# EasyEDA Pro project EMG_v0.0.eprj

# Schematic EMG_v0.0
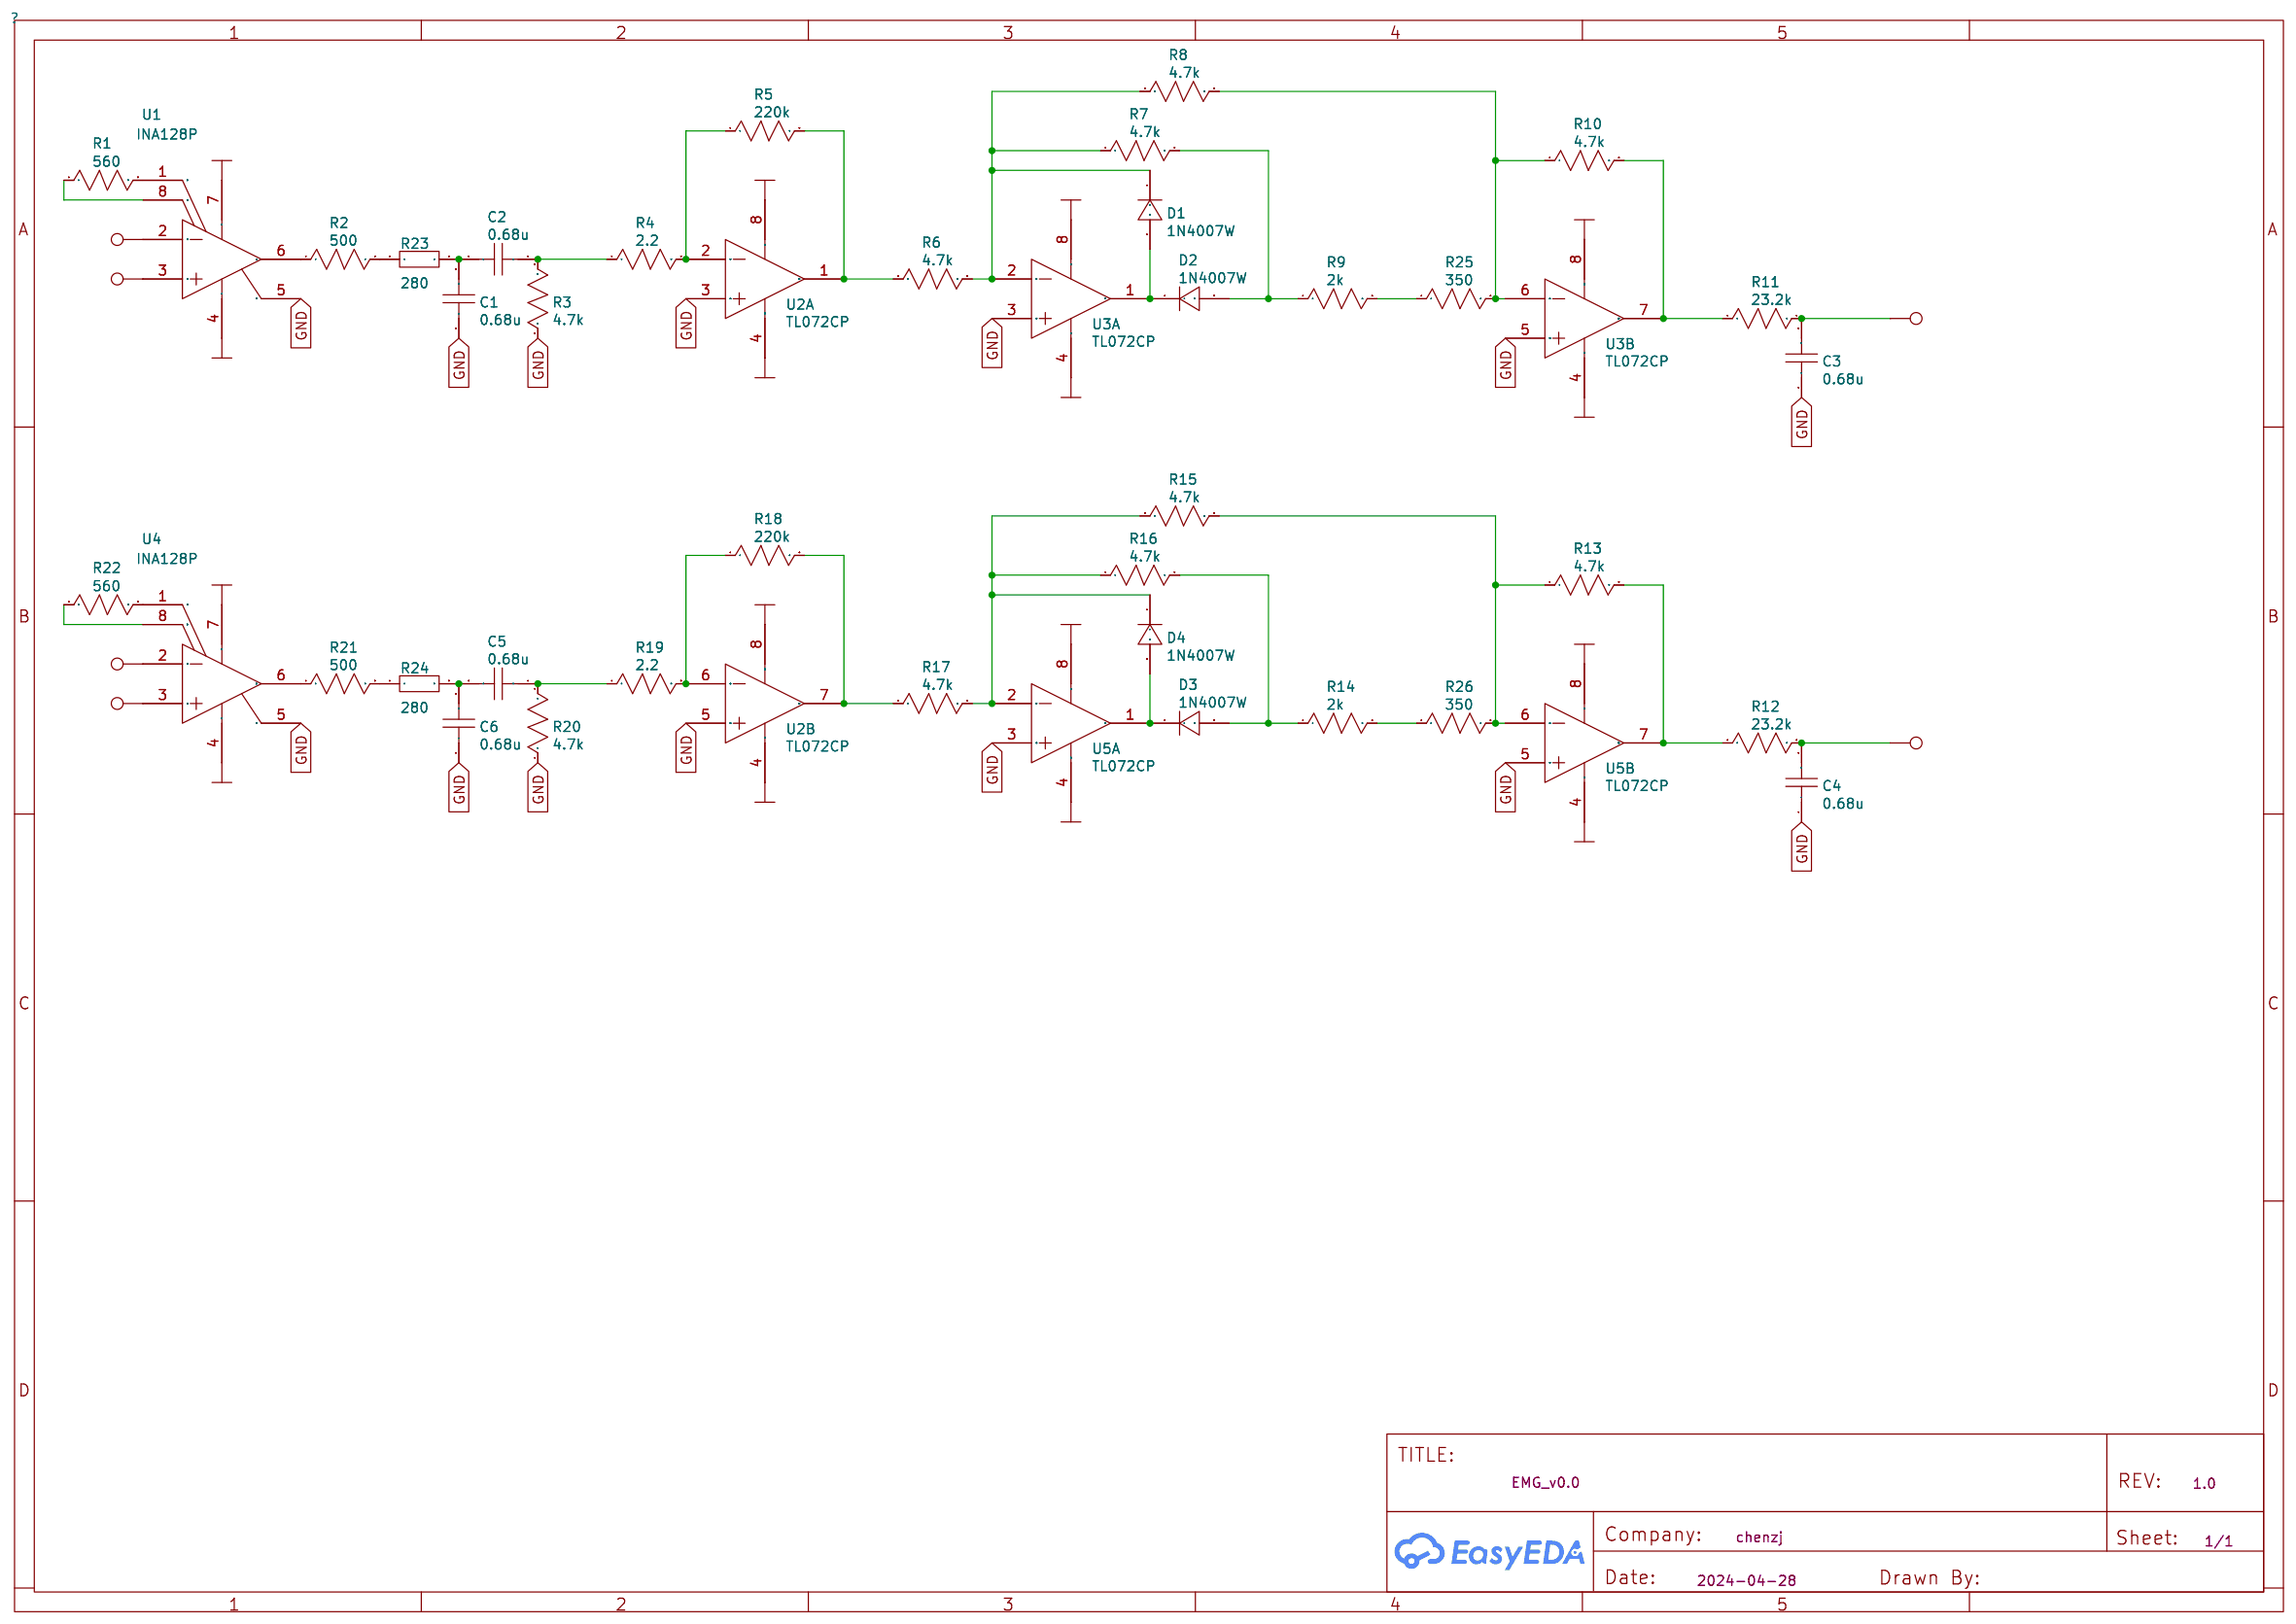
[diagram p0: schematic sheet]

## Parts
C1  0.68u  [C0603]
C2  0.68u  [C0603]
C3  0.68u  [C0603]
C4  0.68u  [C0603]
C5  0.68u  [C0603]
C6  0.68u  [C0603]
D1  1N4007W  [SOD-123_L2.8-W1.8-LS3.7-RD]
D2  1N4007W  [SOD-123_L2.8-W1.8-LS3.7-RD]
D3  1N4007W  [SOD-123_L2.8-W1.8-LS3.7-RD]
D4  1N4007W  [SOD-123_L2.8-W1.8-LS3.7-RD]
R1  560  [R0603]
R2  500  [R0603]
R3  4.7k  [R0603]
R4  2.2  [R0603]
R5  220k  [R0603]
R6  4.7k  [R0603]
R7  4.7k  [R0603]
R8  4.7k  [R0603]
R9  2k  [R0603]
R10  4.7k  [R0603]
R11  23.2k  [R0603]
R12  23.2k  [R0603]
R13  4.7k  [R0603]
R14  2k  [R0603]
R15  4.7k  [R0603]
R16  4.7k  [R0603]
R17  4.7k  [R0603]
R18  220k  [R0603]
R19  2.2  [R0603]
R20  4.7k  [R0603]
R21  500  [R0603]
R22  560  [R0603]
R23  280  [R0201]
R24  280  [R0201]
R25  350  [R0603]
R26  350  [R0603]
U1  INA128P  [PDIP-8_L9.6-W6.4-P2.54-LS7.9-BL]
U2  TL072CP  [DIP-8_L9.6-W6.4-P2.54-LS7.6-BL-1]  (sections 1,2)
U3  TL072CP  [DIP-8_L9.6-W6.4-P2.54-LS7.6-BL-1]  (sections 1,2)
U4  INA128P  [PDIP-8_L9.6-W6.4-P2.54-LS7.9-BL]
U5  TL072CP  [DIP-8_L9.6-W6.4-P2.54-LS7.6-BL-1]  (sections 1,2)

## Library data of the parts
C1 C2 C5 C6 = 0.68u
C3 C4 = 680n
D1-D4 = 1N4007W: Supplier: LCSC; Supplier Part: C328592; Manufacturer: BLUE ROCKET
R1 R22 = 560
R2 R21 = 780
R3 R6-R8 R10 R13 R15-R17 R20 = 4.7k
R4 R19 = 2.2
R5 R18 = 220k
R9 R14 R25 R26 = 2.35k
R11 R12 = 23.2k
R23 R24 = Res_0201: Supplier Footprint: 0201
U1 U4 = INA128P: Supplier: LCSC; Supplier Part: C1348601; Manufacturer: TI(德州仪器); JLCPCB Part Class: Extended Part
U2 U3 U5 = TL072CP: tags: FET Operational Amplifier; Supplier Part: C7236; Supplier: LCSC; Manufacturer: TI(德州仪器); JLCPCB Part Class: Extended Part

## Nets
+5V: U1.7(V+) U2.8(VCC+) U3.8(VCC+) U4.7(V+) U5.8(VCC+)
-5V: U1.4(V-) U2.4(VCC-) U3.4(VCC-) U4.4(V-) U5.4(VCC-)
GND: C1.1 C3.1 C4.1 C6.1 R3.1 R20.1 U1.5(Ref) U2.3(IN1+) U2.5(IN1+) U3.3(IN1+) U3.5(IN1+) U4.5(Ref) U5.3(IN1+) U5.5(IN1+)
VIN1+: U1.3(V+IN)
VIN1-: U1.2(V-IN)
VIN2+: U4.3(V+IN)
VIN2-: U4.2(V-IN)
VOUT1: C3.2 R11.2
VOUT2: C4.2 R12.2
$1N1: R1.1 U1.8(RG)
$1N3: C2.1 R3.2 R4.1
$1N4: R4.2 R5.1 U2.2(IN1-)
$1N5: R5.2 R6.1 U2.1(OUT1)
$1N6: D1.2 D2.1 U3.1(OUT1)
$1N7: D1.1 R6.2 R7.1 R8.1 U3.2(IN1-)
$1N9: D2.2 R7.2 R9.1
$1N10: R8.2 R10.1 R25.2 U3.6(IN1-)
$1N11: R10.2 R11.1 U3.7(OUT1)
$1N14: R12.1 R13.2 U5.7(OUT1)
$1N15: R13.1 R15.2 R26.2 U5.6(IN1-)
$1N17: D3.2 R14.1 R16.2
$1N18: D4.1 R15.1 R16.1 R17.2 U5.2(IN1-)
$1N20: D3.1 D4.2 U5.1(OUT1)
$1N21: R17.1 R18.2 U2.7(OUT1)
$1N22: R18.1 R19.2 U2.6(IN1-)
$1N23: C5.1 R19.1 R20.2
$1N24: R21.1 U4.6(VO)
$1N25: R22.1 U4.8(RG)
$1N715: R1.2 U1.1(RG)
$1N782: R22.2 U4.1(RG)
$1N1481: R2.1 U1.6(VO)
$1N1483: R2.2 R23.1
$1N1485: C1.2 C2.2 R23.2
$1N1511: C5.2 C6.2 R24.2
$1N1513: R21.2 R24.1
$1N2101: R9.2 R25.1
$1N2125: R14.2 R26.1

# Board PCB_EMG_v0.0
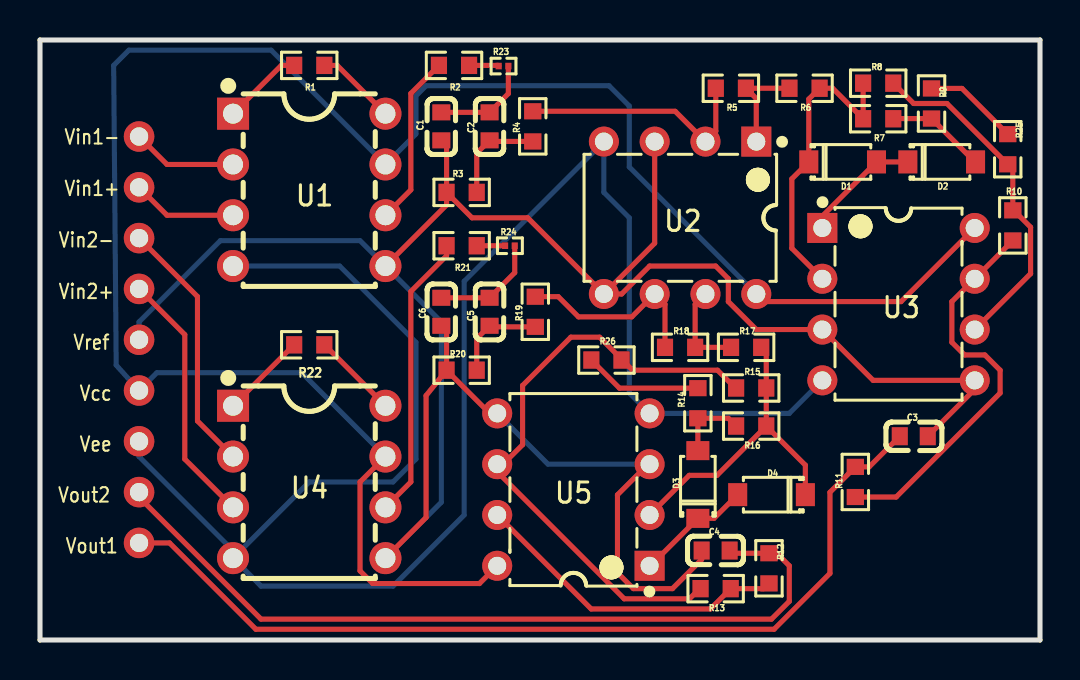
[diagram p1: board, top side]
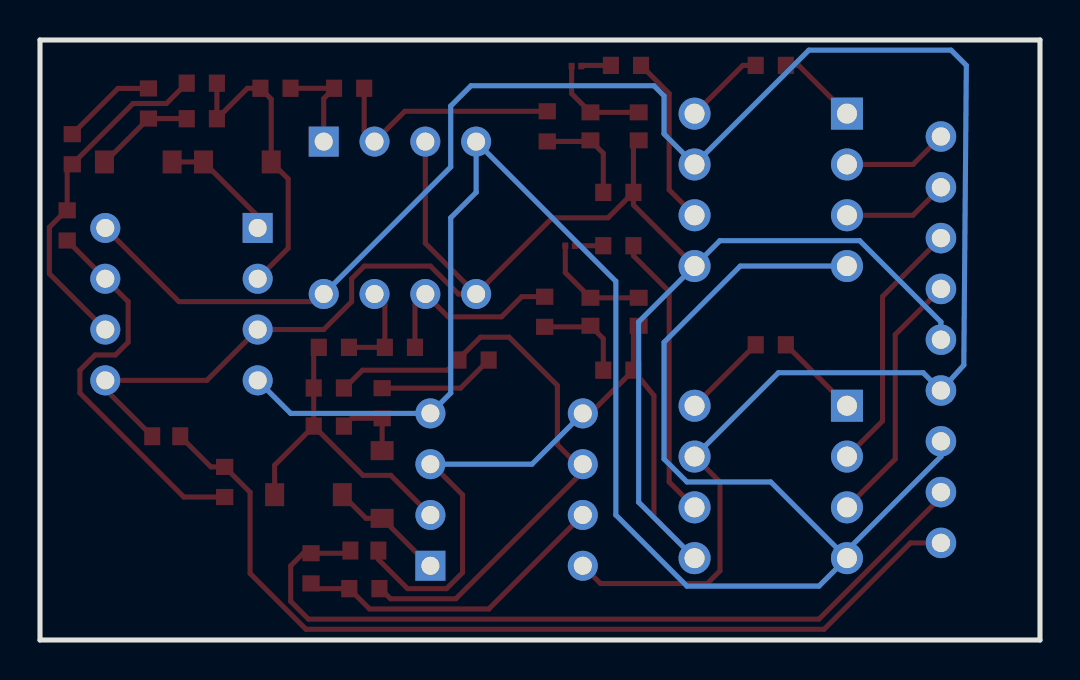
[diagram p2: board, bottom side, seen from below]

Outline 50 x 30 mm; copper layers: Top Layer, Bottom Layer. Coordinates in mm from the lower left corner of the outline.
Outline path: 0,30 50,30 50,0 0,0 0,30
Stack: Top Layer 0.035mm / Dielectric1 1.51mm FR4 er 4.5 / Bottom Layer 0.035mm

## Design rules (mm)
spacing Default (default): track to track 0.152, other pairs 0 to 0.152
track width Default (default): min 0.254, default 0.254, max 25.4
differential pair differentialPair (default): width min 0.127, default 0.254, max 2.54; gap min 0.152, default 0.152
via Default (default): diameter min 0.61, default 0.61, max 100.025; hole min 0.305, default 0.305, max 59.995

## Placement (name value [footprint] x y rotation side)
C1  0.68u  [C0603]  20.07 25.68 90 top
C2  0.68u  [C0603]  22.48 25.68 90 top
C3  0.68u  [C0603]  43.69 10.19 180 top
C4  0.68u  [C0603]  33.78 4.47 0 top
C5  0.68u  [C0603]  22.48 16.41 90 top
C6  0.68u  [C0603]  20.07 16.41 90 top
D1  1N4007W  [SOD-123_L2.8-W1.8-LS3.7-RD]  40.13 23.9 0 top
D2  1N4007W  [SOD-123_L2.8-W1.8-LS3.7-RD]  45.08 23.9 0 top
D3  1N4007W  [SOD-123_L2.8-W1.8-LS3.7-RD]  32.89 7.78 90 top
D4  1N4007W  [SOD-123_L2.8-W1.8-LS3.7-RD]  36.58 7.27 180 top
NOREF  -  [Pad_e657]  4.95 15.01 0 top
NOREF#2  -  [Pad_e661]  4.95 4.85 0 top
NOREF#3  -  [Pad_e660]  4.95 7.39 0 top
NOREF#4  -  [Pad_e654]  4.95 22.63 0 top
NOREF#5  -  [Pad_e655]  4.95 20.09 0 top
NOREF#6  -  [Pad_e658]  4.95 12.47 0 top
NOREF#7  -  [Pad_e659]  4.95 9.93 0 top
NOREF#8  -  [Pad_e653]  4.95 25.17 0 top
NOREF#9  -  [Pad_e656]  4.95 17.55 0 top
R1  560  [R0603]  13.46 28.73 180 top
R2  500  [R0603]  20.7 28.73 0 top
R3  4.7k  [R0603]  21.08 22.38 0 top
R4  2.2  [R0603]  24.64 25.68 90 top
R5  220k  [R0603]  34.54 27.59 0 top
R6  4.7k  [R0603]  38.23 27.59 0 top
R7  4.7k  [R0603]  41.91 26.06 0 top
R8  4.7k  [R0603]  41.91 27.84 0 top
R9  2k  [R0603]  44.58 26.83 90 top
R10  4.7k  [R0603]  48.64 20.73 270 top
R11  23.2k  [R0603]  40.77 7.9 90 top
R12  23.2k  [R0603]  36.45 3.58 90 top
R13  4.7k  [R0603]  33.78 2.57 0 top
R14  2k  [R0603]  32.89 11.84 90 top
R15  4.7k  [R0603]  35.56 12.6 180 top
R16  4.7k  [R0603]  35.56 10.7 180 top
R17  4.7k  [R0603]  35.31 14.63 0 top
R18  220k  [R0603]  32 14.63 0 top
R19  2.2  [R0603]  24.77 16.41 90 top
R20  4.7k  [R0603]  21.08 13.49 0 top
R21  500  [R0603]  21.08 19.71 0 top
R22  560  [R0603]  13.46 14.76 180 top
R23  280  [R0201]  23.18 28.7 0 top
R24  280  [R0201]  23.49 19.71 0 top
R25  350  [R0603]  48.39 24.54 270 top
R26  350  [R0603]  28.32 14 0 top
U1  INA128P  [PDIP-8_L9.6-W6.4-P2.54-LS7.9-BL]  13.46 22.51 270 top
U2  TL072CP  [DIP-8_L9.6-W6.4-P2.54-LS7.6-BL-1]  32 21.11 180 top
U3  TL072CP  [DIP-8_L9.6-W6.4-P2.54-LS7.6-BL-1]  42.93 16.79 270 top
U4  INA128P  [PDIP-8_L9.6-W6.4-P2.54-LS7.9-BL]  13.46 7.9 270 top
U5  TL072CP  [DIP-8_L9.6-W6.4-P2.54-LS7.6-BL-1]  26.67 7.52 90 top

## Footprints (pads in the part's own frame, mm; a bottom-side part is the same pattern mirrored in y, then rotated)
C0603
  rect 0.8x0.9 smd: 1(-0.7,0) 2(0.7,0)
DIP-8_L9.6-W6.4-P2.54-LS7.6-BL-1
  rect 1.5x1.5 hole 0.9: 1(-3.81,-3.81)
  round 1.5 hole 0.9: 2(-1.27,-3.81) 3(1.27,-3.81) 4(3.81,-3.81) 5(3.81,3.81) 6(1.27,3.81) 7(-1.27,3.81) 8(-3.81,3.81)
Pad_e653
  round 1.524 hole 0.914: 1(0,0)
Pad_e654
  round 1.524 hole 0.914: 2(0,0)
Pad_e655
  round 1.524 hole 0.914: 3(0,0)
Pad_e656
  round 1.524 hole 0.914: 4(0,0)
Pad_e657
  round 1.524 hole 0.914: 5(0,0)
Pad_e658
  round 1.524 hole 0.914: 6(0,0)
Pad_e659
  round 1.524 hole 0.914: 7(0,0)
Pad_e660
  round 1.524 hole 0.914: 9(0,0)
Pad_e661
  round 1.524 hole 0.914: 10(0,0)
PDIP-8_L9.6-W6.4-P2.54-LS7.9-BL
  rect 1.6x1.6 hole 1: 1(-3.81,-3.81)
  round 1.6 hole 1: 2(-1.27,-3.81) 3(1.27,-3.81) 4(3.81,-3.81) 5(3.81,3.81) 6(1.27,3.81) 7(-1.27,3.81) 8(-3.81,3.81)
R0201
  rect 0.303x0.324 smd: 1(-0.241,0) 2(0.241,0)
R0603
  rect 0.806x0.864 smd: 1(-0.753,0) 2(0.753,0)
SOD-123_L2.8-W1.8-LS3.7-RD
  rect 0.95x1.15 smd: 1(-1.692,0) 2(1.692,0)

## Nets
+5V: NOREF#6.6 U1.7 U2.8 U3.8 U4.7 U5.8
-5V: NOREF#7.7 U1.4 U2.4 U3.4 U4.4 U5.4
GND: C1.1 C3.1 C4.1 C6.1 NOREF.5 R3.1 R20.1 U1.5 U2.3 U2.5 U3.3 U3.5 U4.5 U5.3 U5.5
VIN1+: NOREF#4.2 U1.3
VIN1-: NOREF#8.1 U1.2
VIN2+: NOREF#9.4 U4.3
VIN2-: NOREF#5.3 U4.2
VOUT1: C3.2 NOREF#2.10 R11.2
VOUT2: C4.2 NOREF#3.9 R12.2
$1N1: R1.1 U1.8
$1N3: C2.1 R3.2 R4.1
$1N4: R4.2 R5.1 U2.2
$1N5: R5.2 R6.1 U2.1
$1N6: D1.2 D2.1 U3.1
$1N7: D1.1 R6.2 R7.1 R8.1 U3.2
$1N9: D2.2 R7.2 R9.1
$1N10: R8.2 R10.1 R25.2 U3.6
$1N11: R10.2 R11.1 U3.7
$1N14: R12.1 R13.2 U5.7
$1N15: R13.1 R15.2 R26.2 U5.6
$1N17: D3.2 R14.1 R16.2
$1N18: D4.1 R15.1 R16.1 R17.2 U5.2
$1N20: D3.1 D4.2 U5.1
$1N21: R17.1 R18.2 U2.7
$1N22: R18.1 R19.2 U2.6
$1N23: C5.1 R19.1 R20.2
$1N24: R21.1 U4.6
$1N25: R22.1 U4.8
$1N715: R1.2 U1.1
$1N782: R22.2 U4.1
$1N1481: R2.1 U1.6
$1N1483: R2.2 R23.1
$1N1485: C1.2 C2.2 R23.2
$1N1511: C5.2 C6.2 R24.2
$1N1513: R21.2 R24.1
$1N2101: R9.2 R25.1
$1N2125: R14.2 R26.1

## Routing (per net, layer and track width the routed paths; a pad name or vN(x,y) marks a point on that pad's centre or on a via; arc(x,y) is an arc through that point)
+5V: length 87.4
  Top Layer w0.254: U3.8 43.05,16.92 36.2,16.92 U2.8
  Bottom Layer w0.254: U2.8 29.46,23.65 29.46,26.7 28.45,27.71 19.3,27.71 18.8,27.21 18.8,25.3 U1.7 11.56,29.49 4.45,29.49 3.68,28.73 3.81,13.74 NOREF#6.6 5.84,13.36 13.08,13.36 U4.7
-5V: length 70.7
  Bottom Layer w0.254: U2.4 21.21,17.94 21.21,6.25 17.65,2.7 11.05,2.7 U4.4 ; U4.4 9.65,4.47 4.95,9.17 NOREF#7.7 ; U4.4 13.46,7.9 17.65,7.9 18.8,9.05 18.8,14.89 14.99,18.7 U1.4
GND: length 97.5
  Top Layer w0.254: C1.1 20.33,24.72 R3.1 ; U2.5 29.08,17.3 30.48,18.7 33.78,18.7 34.42,18.06 34.42,16.92 35.81,15.52 U3.3 41.66,12.98 U3.5 46.74,12.54 C3.1 ; U2.5 24.38,21.11 21.6,21.11 R3.1 ; U2.5 30.73,19.84 U2.3 ; R3.1 20.33,21.75 U1.5 ; C6.1 20.33,15.45 R20.1 19.3,12.22 19.3,6.12 U4.5
  Bottom Layer w0.254: U4.5 20.07,6.89 20.07,15.9 U1.5 16,19.97 9.02,19.97 4.95,15.9 NOREF.5
VIN1+: length 5.3
  Top Layer w0.254: U1.3 6.35,21.24 NOREF#4.2
VIN1-: length 5.3
  Top Layer w0.254: NOREF#8.1 6.35,23.78 U1.2
VIN2+: length 12.9
  Top Layer w0.254: NOREF#9.4 7.24,15.27 7.24,9.05 U4.3
VIN2-: length 12.9
  Top Layer w0.254: NOREF#5.3 7.87,17.17 7.87,10.95 U4.2
VOUT1: length 46.2
  Top Layer w0.254: C3.2 41.46,8.66 R11.2 39.5,7.39 39.5,3.33 36.7,0.54 10.8,0.54 6.48,4.85 NOREF#2.10
VOUT2: length 40.7
  Top Layer w0.254: NOREF#3.9 4.95,7.14 11.05,1.04 36.58,1.04 37.46,1.93 37.46,3.71 36.84,4.34 R12.2 34.62,4.34 C4.2
$1N1: length 4.1
  Top Layer w0.254: R1.1 14.86,28.73 U1.8
$1N3: length 5
  Top Layer w0.254: R3.2 21.84,24.34 C2.1 22.53,24.93 R4.1
$1N4: length 12.1
  Top Layer w0.254: R5.1 33.79,25.44 U2.2 31.76,26.44 R4.2
$1N5: length 5.1
  Top Layer w0.254: U2.1 35.81,27.07 R5.2 R6.1
$1N6: length 6
  Top Layer w0.254: D2.1 D1.2 39.12,21.2 U3.1
$1N7: length 15.3
  Top Layer w0.254: R8.1 R7.1 39.63,27.59 38.98,27.59 ; U3.2 37.59,19.59 37.59,23.06 D1.1 38.44,27.05 R6.2
$1N9: length 5
  Top Layer w0.254: D2.2 46.74,23.9 R9.1 42.67,26.07 R7.2
$1N11: length 19.9
  Top Layer w0.254: R10.2 U3.7 45.59,16.92 45.59,14.89 46.23,14.25 47.24,14.25 48.01,13.49 48.01,12.35 42.81,7.15 R11.1
$1N17: length 3.7
  Top Layer w0.254: R16.2 34.42,11.09 R14.1 D3.2
$1N21: length 4.7
  Top Layer w0.254: U2.7 32.76,16.78 R18.2 R17.1
$1N22: length 9.7
  Top Layer w0.254: 24.77,17.17 25.92,17.17 26.92,16.16 29.59,16.16 U2.6 31.25,16.78 R18.1
$1N23: length 4.8
  Top Layer w0.254: R19.1 22.53,15.66 C5.1 21.84,15.07 R20.2
$1N24: length 14.3
  Top Layer w0.254: R21.1 20.33,19.21 18.54,17.43 18.54,7.9 U4.6
$1N25: length 4.3
  Top Layer w0.254: U4.8 14.22,14.76 R22.1
$1N715: length 4.1
  Top Layer w0.254: R1.2 12.07,28.73 U1.1
$1N782: length 4.3
  Top Layer w0.254: R22.2 12.7,14.76 U4.1
$1N1481: length 8.6
  Top Layer w0.254: 19.95,28.73 18.54,27.33 18.54,22.51 U1.6
$1N10: length 17.3
  Top Layer w0.254: R8.2 43.68,26.83 45.35,26.83 R25.2 ; 48.39,23.74 48.64,23.49 R10.1 ; 48.64,21.53 49.53,20.64 49.53,18.32 U3.6
$1N14: length 16.1
  Top Layer w0.254: U5.7 27.56,1.55 33.52,1.55 R13.2 36.19,2.57 R12.1
$1N15: length 30.7
  Top Layer w0.254: 32.98,2.57 32.47,2.06 29.21,2.06 22.86,8.41 U5.6 23.16,8.79 24.13,9.76 24.13,12.73 26.54,15.14 27.98,15.14 29.63,13.49 33.88,13.49 34.77,12.6
$1N18: length 16
  Top Layer w0.254: U5.2 32.46,8.23 33.85,8.23 R16.1 ; R16.1 R15.1 36.31,14.38 R17.2 ; R16.1 38.27,8.74 D4.1
$1N20: length 5.9
  Top Layer w0.254: U5.1 30.52,3.71 D3.1 33.7,6.08 D4.2
$1N1483: length 1.5
  Top Layer w0.254: R2.2 22.9,28.73 R23.1
$1N1485: length 5.1
  Top Layer w0.254: C1.2 C2.2 23.42,27.32 R23.2
$1N1511: length 5.5
  Top Layer w0.254: C6.2 C5.2 23.74,18.37 R24.2
$1N1513: length 1.4
  Top Layer w0.254: 21.88,19.71 R24.1
$1N2101: length 4.8
  Top Layer w0.254: R9.2 46.1,27.58 R25.1
$1N2125: length 5.9
  Top Layer w0.254: R26.1 28.97,12.59 R14.2

## Text on the board
Top Silkscreen Layer: Vout2 | Vin2- | Vin2+ | Vin1- | Vin1+ | Vout1 | Vref | Vcc | Vee
